# EAGLE design CBM Drive ID Switch Rev 1.1 (EAGLE 9.7.0)
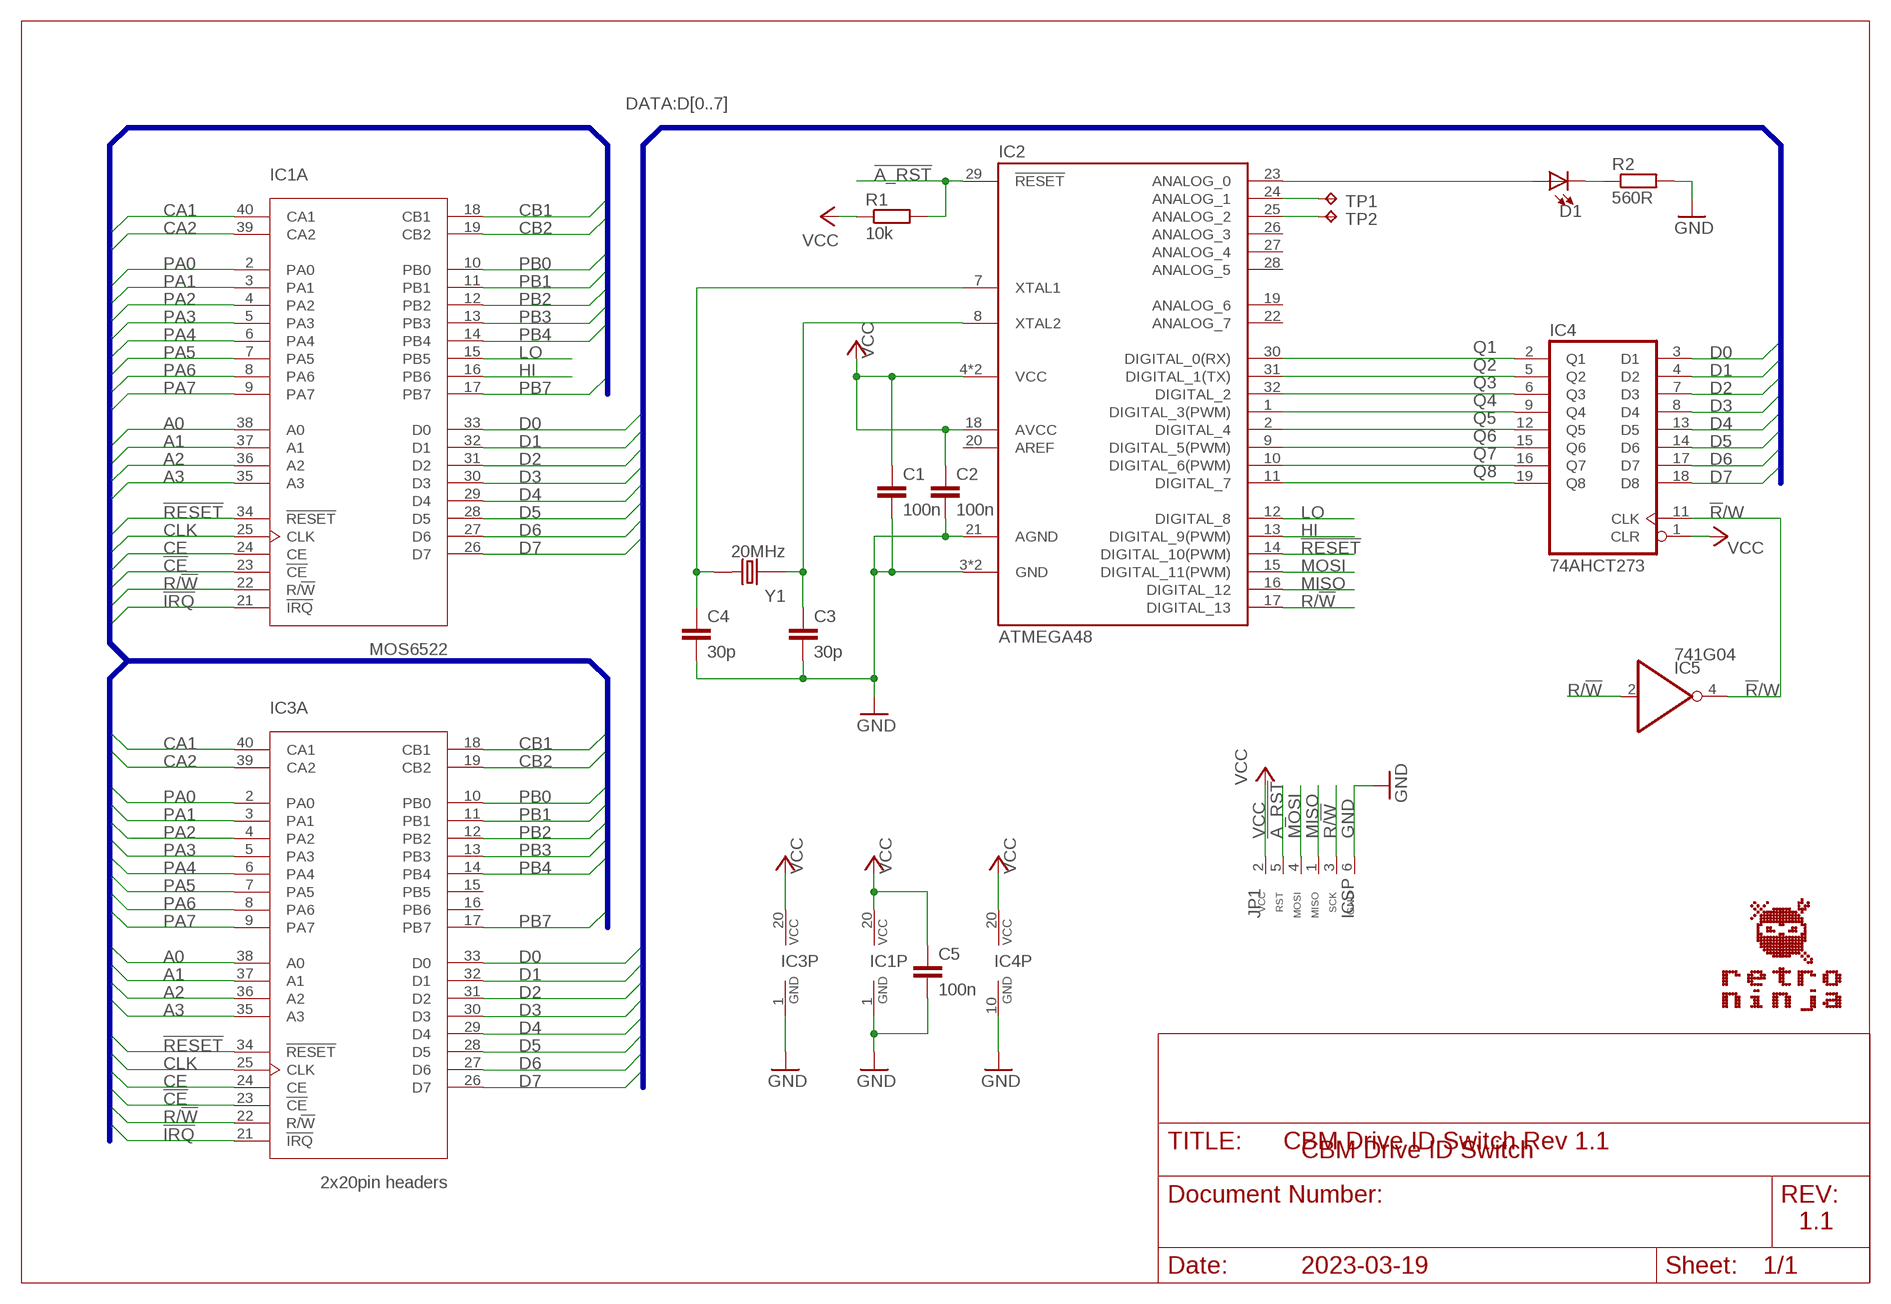
[diagram p0: schematic, sheet 1]

## Parts
C1  100n  C-EUC0805  [C0805]
C2  100n  C-EUC0805  [C0805]
C3  30p  C-EUC0805  [C0805]
C4  30p  C-EUC0805  [C0805]
C5  100n  C-EUC0805  [C0805]
D1  LED_0805  [LED0805]
IC1  MOS6522  MOS6522_HEADERS-F  [DIL40-6_HEADERS-F]
IC2  ATMEGA48  ARDUINO_168_328_TQFP  [TQFP-32]
IC3  2x20pin headers  MOS6522_ROUND_BOTTOMPINS  [DIL40-6_ROUND_BOTTOMPINS]
IC4  74AHCT273  74273N_NARROW  [SO20_NARROW]
IC5  741G04  741G04_SOT23  [SOT23-5]
JP1  ICSP  ICSP_CONNECTOR_6_ALT  [HEADER_2X3_ALT]
R1  10k  R-EU_R0805  [R0805]
R2  560R  R-EU_R0805  [R0805]
TP1  TPTP20SQ  [TP20SQ]
TP2  TPTP20SQ  [TP20SQ]
Y1  20MHz  CRYSTAL  [CRYSTAL_SMD-2_7X4X2.3]

## Nets
!A_RST: IC2.29(!RESET) JP1.5(RST) R1.2
!CE: IC1.23(A:!CE) IC3.23(A:!CE)
!IRQ: IC1.21(A:!IRQ) IC3.21(A:!IRQ)
!R!/W: IC4.11(CLK) IC5.4(O)
!RESET: IC1.34(A:!RESET) IC2.14(DIGITAL_10(PWM)) IC3.34(A:!RESET)
A0: IC1.38(A:A0) IC3.38(A:A0)
A1: IC1.37(A:A1) IC3.37(A:A1)
A2: IC1.36(A:A2) IC3.36(A:A2)
A3: IC1.35(A:A3) IC3.35(A:A3)
CA1: IC1.40(A:CA1) IC3.40(A:CA1)
CA2: IC1.39(A:CA2) IC3.39(A:CA2)
CB1: IC1.18(A:CB1) IC3.18(A:CB1)
CB2: IC1.19(A:CB2) IC3.19(A:CB2)
CE: IC1.24(A:CE) IC3.24(A:CE)
CLK: IC1.25(A:CLK) IC3.25(A:CLK)
D0: IC1.33(A:D0) IC3.33(A:D0) IC4.3(D1)
D1: IC1.32(A:D1) IC3.32(A:D1) IC4.4(D2)
D2: IC1.31(A:D2) IC3.31(A:D2) IC4.7(D3)
D3: IC1.30(A:D3) IC3.30(A:D3) IC4.8(D4)
D4: IC1.29(A:D4) IC3.29(A:D4) IC4.13(D5)
D5: IC1.28(A:D5) IC3.28(A:D5) IC4.14(D6)
D6: IC1.27(A:D6) IC3.27(A:D6) IC4.17(D7)
D7: IC1.26(A:D7) IC3.26(A:D7) IC4.18(D8)
GND: C1.2 C2.2 C3.2 C4.2 C5.2 IC1.1(P:GND) IC2.3(GND) IC2.5(GND) IC2.21(AGND) IC3.1(P:GND) IC4.10(GND) JP1.6(GND) R2.2
HI: IC1.16(A:PB6) IC2.13(DIGITAL_9(PWM))
LO: IC1.15(A:PB5) IC2.12(DIGITAL_8)
MISO: IC2.16(DIGITAL_12) JP1.1(MISO)
MOSI: IC2.15(DIGITAL_11(PWM)) JP1.4(MOSI)
N$1: IC2.24(ANALOG_1) TP1.TP
N$2: IC2.25(ANALOG_2) TP2.TP
N$16: C3.1 IC2.8(XTAL2) Y1.1
N$17: C4.1 IC2.7(XTAL1) Y1.2
N$25: D1.A IC2.23(ANALOG_0)
N$26: D1.C R2.1
PA0: IC1.2(A:PA0) IC3.2(A:PA0)
PA1: IC1.3(A:PA1) IC3.3(A:PA1)
PA2: IC1.4(A:PA2) IC3.4(A:PA2)
PA3: IC1.5(A:PA3) IC3.5(A:PA3)
PA4: IC1.6(A:PA4) IC3.6(A:PA4)
PA5: IC1.7(A:PA5) IC3.7(A:PA5)
PA6: IC1.8(A:PA6) IC3.8(A:PA6)
PA7: IC1.9(A:PA7) IC3.9(A:PA7)
PB0: IC1.10(A:PB0) IC3.10(A:PB0)
PB1: IC1.11(A:PB1) IC3.11(A:PB1)
PB2: IC1.12(A:PB2) IC3.12(A:PB2)
PB3: IC1.13(A:PB3) IC3.13(A:PB3)
PB4: IC1.14(A:PB4) IC3.14(A:PB4)
PB7: IC1.17(A:PB7) IC3.17(A:PB7)
Q1: IC2.30(DIGITAL_0(RX)) IC4.2(Q1)
Q2: IC2.31(DIGITAL_1(TX)) IC4.5(Q2)
Q3: IC2.32(DIGITAL_2) IC4.6(Q3)
Q4: IC2.1(DIGITAL_3(PWM)) IC4.9(Q4)
Q5: IC2.2(DIGITAL_4) IC4.12(Q5)
Q6: IC2.9(DIGITAL_5(PWM)) IC4.15(Q6)
Q7: IC2.10(DIGITAL_6(PWM)) IC4.16(Q7)
Q8: IC2.11(DIGITAL_7) IC4.19(Q8)
R/!W: IC1.22(A:R/!W) IC2.17(DIGITAL_13) IC3.22(A:R/!W) IC5.2(I) JP1.3(SCK)
VCC: C1.1 C2.1 C5.1 IC1.20(P:VCC) IC2.4(VCC) IC2.6(VCC) IC2.18(AVCC) IC3.20(P:VCC) IC4.1(CLR) IC4.20(VCC) JP1.2(VCC) R1.1
Unconnected: IC2.19(ANALOG_6) IC2.20(AREF) IC2.22(ANALOG_7) IC2.26(ANALOG_3) IC2.27(ANALOG_4) IC2.28(ANALOG_5) IC3.15(A:PB5) IC3.16(A:PB6)

## Buses
DATA:D[0..7]
A[0..3],CA[1..2],CB[1..2],CE,!CE,CLK,!IRQ,PA[0..7],PB[0..7],!RESET,R/!W

## Notes on the sheet
- CBM Drive ID Switch
- 1.1
- 2023-03-19

## Power pins joined to a net without a drawn wire
GND: IC5.3(GND)
VCC: IC5.5(VCC)

## Library data of the parts
C1-C5 = rcl:C-EU: CAPACITOR, European symbol; SPICEPREFIX: C
D1 = Per (Fusion 360):LED
IC1 IC3 = Per (Fusion 360):MOS6522
IC2 = Per (Fusion 360):ARDUINO_168_328
IC4 = Per (Fusion 360):74*273
IC5 = Per (Fusion 360):74*1G04
JP1 = Per (Fusion 360):ICSP_CONNECTOR: PIN HEADER
R1 R2 = rcl:R-EU_: RESISTOR, European symbol; SPICEPREFIX: R
TP1 TP2 = testpad:TP: Test pad
Y1 = Per (Fusion 360):CRYSTAL

## Board
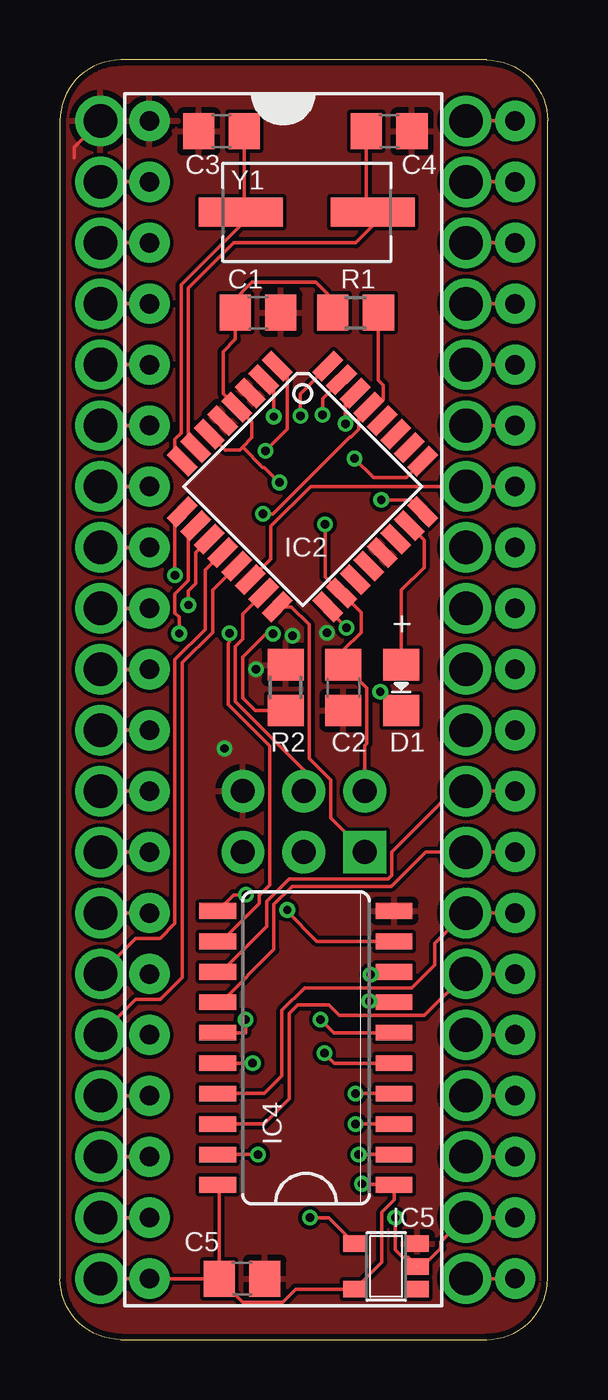
[diagram p1: board, top side]
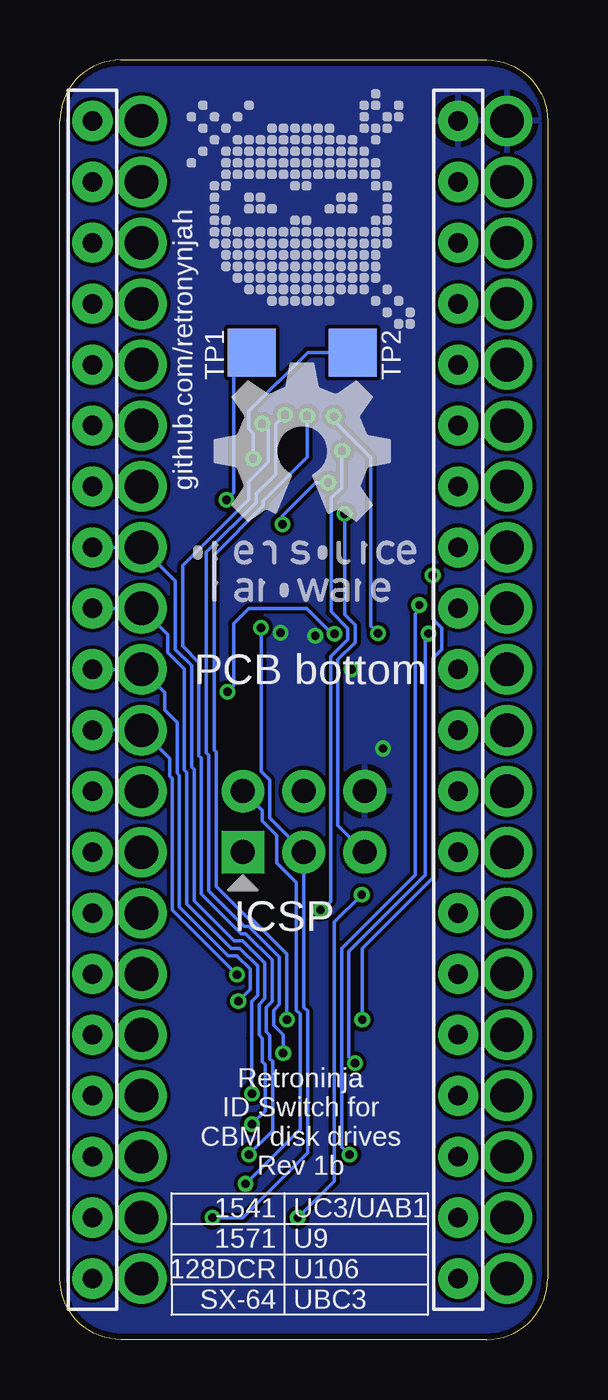
[diagram p2: board, bottom side, seen from below]

Size 20.32 x 53.34 mm. Coordinates in mm from the lower left corner, seen from the top.
Outline: 2.54,0 17.78,0 arc90 20.32,2.54 20.32,50.8 arc90 17.78,53.34 2.54,53.34 arc90 0,50.8 0,2.54 arc90 2.54,0
Copper layers (1*16): Top 0.035mm / dielectric 1.5mm / Bottom 0.035mm
Design rules "SeeedStudio_2layer_DRU_no_angle_20140221": minimum track width 6mil, minimum drill 12mil, track to track 6mil, track to pad 6mil, pad to pad 6mil, via to via 6mil, smd to smd 0mil, copper to edge 10mil, drill to drill 10mil, minimum pad ring 10mil, minimum via ring 6mil, stop-mask expansion 2mil, vias tented up to drill 100mil, thermal gap 10mil

### Footprints (pad centres in the part's own frame; a part is rotated, then mirrored left to right if it is on the bottom)
C0805 = smd 1.3 x 1.5: 1 -0.95,0; 2 0.95,0
LED0805 = smd 1.3 x 1.5: A -0.95,0; C 0.95,0
DIL40-6_HEADERS-F = drill 1.4: 1 -24.13,-7.62; 2 -21.59,-7.62; 3 -19.05,-7.62; 4 -16.51,-7.62; 5 -13.97,-7.62; 6 -11.43,-7.62; 7 -8.89,-7.62; 8 -6.35,-7.62; 9 -3.81,-7.62; 10 -1.27,-7.62; 11 1.27,-7.62; 12 3.81,-7.62; 13 6.35,-7.62; 14 8.89,-7.62; 15 11.43,-7.62; 16 13.97,-7.62; 17 16.51,-7.62; 18 19.05,-7.62; 19 21.59,-7.62; 20 24.13,-7.62; 21 24.13,7.62; 22 21.59,7.62; 23 19.05,7.62; 24 16.51,7.62; 25 13.97,7.62; 26 11.43,7.62; 27 8.89,7.62; 28 6.35,7.62; 29 3.81,7.62; 30 1.27,7.62; 31 -1.27,7.62; 32 -3.81,7.62; 33 -6.35,7.62; 34 -8.89,7.62; 35 -11.43,7.62; 36 -13.97,7.62; 37 -16.51,7.62; 38 -19.05,7.62; 39 -21.59,7.62; 40 -24.13,7.62
TQFP-32 = smd 1.27 x 0.559: 1 -4.293,2.8; 2 -4.293,2; 3 -4.293,1.2; 4 -4.293,0.4; 5 -4.293,-0.4; 6 -4.293,-1.2; 7 -4.293,-2; 8 -4.293,-2.8; 17 4.293,-2.8; 18 4.293,-2; 19 4.293,-1.2; 20 4.293,-0.4; 21 4.293,0.4; 22 4.293,1.2; 23 4.293,2; 24 4.293,2.8 | smd 0.559 x 1.27: 9 -2.8,-4.293; 10 -2,-4.293; 11 -1.2,-4.293; 12 -0.4,-4.293; 13 0.4,-4.293; 14 1.2,-4.293; 15 2,-4.293; 16 2.8,-4.293; 25 2.8,4.293; 26 2,4.293; 27 1.2,4.293; 28 0.4,4.293; 29 -0.4,4.293; 30 -1.2,4.293; 31 -2,4.293; 32 -2.8,4.293
DIL40-6_ROUND_BOTTOMPINS = drill 0.813 pad 1.676: 1 -24.13,-7.62; 2 -21.59,-7.62; 3 -19.05,-7.62; 4 -16.51,-7.62; 5 -13.97,-7.62; 6 -11.43,-7.62; 7 -8.89,-7.62; 8 -6.35,-7.62; 9 -3.81,-7.62; 10 -1.27,-7.62; 11 1.27,-7.62; 12 3.81,-7.62; 13 6.35,-7.62; 14 8.89,-7.62; 15 11.43,-7.62; 16 13.97,-7.62; 17 16.51,-7.62; 18 19.05,-7.62; 19 21.59,-7.62; 20 24.13,-7.62; 21 24.13,7.62; 22 21.59,7.62; 23 19.05,7.62; 24 16.51,7.62; 25 13.97,7.62; 26 11.43,7.62; 27 8.89,7.62; 28 6.35,7.62; 29 3.81,7.62; 30 1.27,7.62; 31 -1.27,7.62; 32 -3.81,7.62; 33 -6.35,7.62; 34 -8.89,7.62; 35 -11.43,7.62; 36 -13.97,7.62; 37 -16.51,7.62; 38 -19.05,7.62; 39 -21.59,7.62; 40 -24.13,7.62
SO20_NARROW = smd 0.66 x 1.524: 1 -5.369,-3.765; 2 -4.099,-3.765; 3 -2.829,-3.765; 4 -1.559,-3.765; 5 -0.289,-3.765; 6 0.981,-3.765; 7 2.251,-3.765; 8 3.521,-3.765; 9 4.791,-3.765; 10 6.061,-3.765; 11 6.061,3.585; 12 4.791,3.585; 13 3.521,3.585; 14 2.251,3.585; 15 0.981,3.585; 16 -0.289,3.585; 17 -1.559,3.585; 18 -2.829,3.585; 19 -4.099,3.585; 20 -5.369,3.585
SOT23-5 = smd 0.69 x 0.99: 1 -0.95,-1.29; 2 0,-1.29; 3 0.95,-1.29; 4 0.95,1.3; 5 -0.95,1.3
HEADER_2X3_ALT = drill 1 pad 1.778 square: 1 -2.54,-1.27 | drill 1 pad 1.778: 2 -2.54,1.27; 3 0,-1.27; 4 0,1.27; 5 2.54,-1.27; 6 2.54,1.27
R0805 = smd 1.3 x 1.5: 1 -0.95,0; 2 0.95,0
TP20SQ = smd 2 x 2: TP 0,0
CRYSTAL_SMD-2_7X4X2.3 = smd 3.5 x 1.2: 1 -2.75,0; 2 2.75,0

### Placement (x,y rotation side)
C1  8.26,42.8 0 top
C2  11.81,27.18 270 top
C3  6.73,50.37 180 top
C4  13.72,50.37 0 top
C5  7.59,2.54 0 top
D1  14.22,27.18 270 top
IC1  9.3,26.67 270 top
IC2  10.11,35.56 315 top
IC3  11.35,26.67 270 top
IC4  10.16,11.81 90 top
IC5  13.59,3.05 90 top
JP1  10.16,21.59 0 bottom
R1  12.32,42.8 0 top
R2  9.4,27.18 90 top
TP1  12.32,41.15 0 bottom
TP2  8.13,41.15 0 bottom
U$1  [RETRONINJA_NOTEXT_10MM]  10.29,47.37 0 bottom
U$2  [OSHW_10MM]  14.99,30.73 0 bottom
Y1  10.29,46.99 0 top

### Tracks (layer width: path | path; a pad name or v marks a point on that pad's centre or on a via)
!A_RST  (via drill 0.35)
  Top 0.152: R1.2 13.27,40 13.48,39.79 13.48,39.19 IC2.29 12.45,38.47 12.45,37.95 12.12,37.62 12.08,37.62 8.88,34.42 v8.46,34.42
  Bottom 0.152: JP1.5 8.74,21.44 8.74,28.34 8.02,29.06 8.02,29.77 8.46,30.22 v8.46,34.42
!CE
  Top 0.152: IC1.23 IC3.23
!IRQ
  Top 0.152: IC1.21 IC3.21
!R!/W  (via drill 0.35)
  Top 0.152: IC5.4 11.21,5.08 v10.41,5.08 | v7.75,18.54 7.24,18.54 IC4.11
  Bottom 0.152: v10.41,5.08 8.89,6.6 8.89,17.4 v7.75,18.54
!RESET
  Top 0.152: IC3.34 IC1.34 10.45,35.56 8.79,33.9 8.79,32.54 IC2.14
A0
  Top 0.152: IC1.38 IC3.38
A1
  Top 0.152: IC1.37 IC3.37
A2
  Top 0.152: IC1.36 IC3.36
A3
  Top 0.152: IC1.35 IC3.35
CA1
  Top 0.152: IC1.40 IC3.40
CA2
  Top 0.152: IC3.39 IC1.39
CB1
  Top 0.152: IC1.18 IC3.18
CB2
  Top 0.152: IC1.19 IC3.19
CE
  Top 0.152: IC1.24 IC3.24
CLK
  Top 0.152: IC3.25 IC1.25
D0  (via drill 0.35)
  Top 0.152: IC4.3 v12.32,8.98
  Bottom 0.152: IC3.33 IC1.33 15.52,31.61 15.52,28.77 14.83,28.09 14.83,23.87 14.73,23.77 14.73,18.29 13.06,16.61 12.7,16.61 11.78,15.7 11.78,14.22 12.03,13.98 12.03,12.69 11.88,12.55 11.88,11.58 11.76,11.46 11.76,9.54 v12.32,8.98
D1  (via drill 0.35)
  Top 0.152: IC4.4 v12.32,10.25
  Bottom 0.152: IC3.32 IC1.32 15.82,29.38 15.82,28.65 15.14,27.96 15.14,23.74 15.04,23.64 15.04,18.16 13.18,16.31 12.82,16.31 12.09,15.57 12.09,14.35 12.33,14.1 12.33,12.57 12.32,12.55 v12.32,10.25
D2  (via drill 0.35)
  Top 0.152: IC4.7 12.93,14.06 v12.89,14.1
  Bottom 0.152: IC3.31 IC1.31 15.95,26.97 15.95,26.23 15.44,25.73 15.44,23.62 15.34,23.52 15.34,18.04 13.31,16 12.95,16 12.39,15.45 12.39,14.6 v12.89,14.1
D3  (via drill 0.35)
  Top 0.152: IC4.8 13.07,15.33 v12.95,15.21
  Bottom 0.152: IC3.30 IC1.30 15.75,24.22 15.75,23.49 15.65,23.39 15.65,17.91 13.43,15.7 v12.95,15.21
D4
  Top 0.152: IC3.29 IC1.29 16.36,22.86 13.82,20.32 13.82,19.34 13.68,19.2 9.55,19.2 8.61,18.26 8.61,17.22 6.72,15.33 IC4.13
D5
  Top 0.152: IC3.28 IC1.28 15.23,20.32 13.81,18.9 9.67,18.9 8.91,18.14 8.91,16.25 6.72,14.06 IC4.14
D6
  Top 0.152: IC4.17 8.51,10.25 9.25,10.99 9.25,13.71 10.2,14.66 14.67,14.66 15.62,15.61 15.62,16.51 16.89,17.78 IC1.27 IC3.27
D7
  Top 0.152: IC4.18 8.51,8.98 9.55,10.03 9.55,13.59 9.91,13.94 11.2,13.94 11.64,13.5 15.19,13.5 IC1.26 IC3.26
GND  (via drill 0.35)
  Top 0.152: IC1.1 0.58,49.7 0.58,49.28
  other vias: 9.68,29.34 6.86,24.64 8.17,27.94 11.13,29.46
  pour Bottom: 0.08,0.08 20.24,0.08 20.24,53.26 0.08,53.26
  pour Top: 0.08,0.08 20.24,0.08 20.24,53.26 0.08,53.26
HI
  Top 0.152: IC1.16 3.16,14.17 4.17,14.17 5.1,15.1 5.1,28.22 6.36,29.48 6.36,31.25 IC2.13
LO
  Top 0.152: IC1.15 3.16,16.71 4.17,16.71 4.79,17.34 4.79,28.34 6.06,29.61 6.06,32.07 IC2.12
MISO
  Top 0.152: JP1.1 11.28,21.74 11.28,23.32 10.38,24.22 10.38,29.81 9.64,30.55 IC2.16
MOSI
  Top 0.152: JP1.4 10.16,23.74 7.31,26.59 7.31,28.9 7.62,29.21 7.62,30.24 IC2.15
N$1  (via drill 0.35)
  Top 0.152: IC2.24 14.63,35 v13.39,35
  Bottom 0.152: v13.39,35 13.08,35.31 13.08,40.39 TP1.TP
N$2  (via drill 0.35)
  Top 0.152: v12.27,36.73 13.07,35.92 14.43,35.92 IC2.25
  Bottom 0.152: TP2.TP 10,41.15 11.22,39.92 11.24,39.92 12.45,38.71 12.45,37.95 12.27,37.77 v12.27,36.73
N$16
  Top 0.152: C3.1 7.68,47.39 Y1.1 7.54,46.45 5.05,43.97 5.04,43.96 5.04,37.79 4.78,37.53 4.78,36.92 IC2.8
N$17
  Top 0.152: C4.1 12.77,47.26 Y1.2 13.04,46.44 12.32,45.72 7.24,45.72 5.35,43.83 5.35,37.49 IC2.7
N$25
  Top 0.152: D1.A 14.22,31.24 15.17,32.19 15.17,33.33 IC2.23
N$26  (via drill 0.35)
  Top 0.152: R2.1 8.13,26.23 7.61,26.74 7.61,28.45 8.58,29.42 v8.88,29.42 | v13.35,27 14.12,26.23 D1.C
  Bottom 0.152: v13.35,27 13.08,27.26 13.08,29.84 12.45,30.48 10.04,30.48 8.98,29.42 v8.88,29.42
PA0
  Top 0.152: IC3.2 IC1.2
PA1
  Top 0.152: IC1.3 IC3.3
PA2
  Top 0.152: IC3.4 IC1.4
PA3
  Top 0.152: IC1.5 IC3.5
PA4
  Top 0.152: IC1.6 IC3.6
PA5
  Top 0.152: IC1.7 IC3.7
PA6
  Top 0.152: IC1.8 IC3.8
PA7
  Top 0.152: IC1.9 IC3.9
PB0
  Top 0.152: IC1.10 IC3.10
PB1
  Top 0.152: IC1.11 IC3.11
PB2
  Top 0.152: IC1.12 IC3.12
PB3
  Top 0.152: IC1.13 IC3.13
PB4
  Top 0.152: IC1.14 IC3.14
PB7
  Top 0.152: IC1.17 IC3.17
Q1  (via drill 0.35)
  Top 0.152: IC4.2 v12.45,7.71 | v11.89,38.18 11.89,39.04 IC2.30
  Bottom 0.152: v11.89,38.18 11.64,37.93 11.64,36.57 12.45,35.76 12.45,35.02 15.21,32.26 15.21,28.9 14.53,28.21 14.53,24.34 14.43,24.23 14.43,18.57 12.78,16.92 12.57,16.92 11.48,15.82 11.48,14.09 11.72,13.85 11.72,12.82 11.58,12.67 11.58,11.71 11.46,11.59 11.46,8.7 v12.45,7.71
Q2  (via drill 0.35)
  Top 0.152: v10.94,38.55 10.94,39.22 IC2.31 | IC4.5 11.44,11.52 v11.02,11.94
  Bottom 0.152: v10.94,38.55 11.34,38.15 11.34,36.06 12.14,35.26 12.14,34.9 14.22,32.82 14.22,24.46 14.12,24.36 14.12,18.69 12.65,17.22 12.45,17.22 11.17,15.95 11.17,13.97 11.42,13.72 11.42,13.11 11.02,12.71 v11.02,11.94
Q3  (via drill 0.35)
  Top 0.152: v10.02,38.51 10.01,38.52 10.01,39.42 IC2.32 | IC4.6 11.4,12.79 v10.86,13.34
  Bottom 0.152: v10.02,38.51 10.01,38.49 10.01,36.79 11.84,34.96 11.84,34.77 13.9,32.71 13.9,24.57 13.82,24.49 13.82,18.9 12.45,17.53 12.32,17.53 10.86,16.07 v10.86,13.34
Q4  (via drill 0.35)
  Top 0.152: IC4.9 10.7,16.6 9.47,17.84 v9.47,17.91 | IC2.1 9.46,40.16 9.46,37.94 v8.56,37.04
  Bottom 0.152: v8.56,37.04 8.59,37.02 8.59,35.5 9.02,35.07 9.02,30.35 8.32,29.65 8.32,29.19 9.04,28.46 9.04,18.26 9.4,17.91 v9.47,17.91
Q5  (via drill 0.35)
  Top 0.152: v7.06,29.44 7.06,29.08 7,29.02 7,26.47 8.74,24.73 8.74,18.94 8.3,18.51 8.3,18.18 6.72,16.6 IC4.12 | IC2.2 8.91,39.59 v8.91,38.47
  Bottom 0.152: v7.06,29.44 7.37,29.74 7.37,36.76 8.91,38.3 v8.91,38.47
Q6  (via drill 0.35)
  Top 0.152: IC4.15 7.75,12.79 7.75,13.31 v7.72,13.34 | v4.79,31.86 4.79,32.52 4.79,33.59 4.78,33.59 4.78,34.2 IC2.9
  Bottom 0.152: v4.79,31.86 4.79,31.83 4.79,30.04 4.41,29.66 4.41,28.76 4.79,28.38 4.79,19.24 7.72,16.3 v7.72,13.34
Q7  (via drill 0.35)
  Top 0.152: v4.97,29.43 4.97,30.11 4.79,30.29 4.79,31.08 5.35,31.63 5.35,33.62 IC2.10 | v8.03,11.52 IC4.16
  Bottom 0.152: v4.97,29.43 5.1,29.3 5.1,19.36 8.28,16.18 8.28,11.77 v8.03,11.52
Q8  (via drill 0.35)
  Top 0.152: IC4.19 v8.26,7.71 | v5.35,30.62 5.35,31.2 5.65,31.51 5.65,32.8 IC2.11
  Bottom 0.152: v5.35,30.62 5.35,30.42 5.53,30.24 5.53,19.37 8.59,16.31 8.59,8.04 v8.26,7.71
R/!W  (via drill 0.35)
  Top 0.152: IC3.22 IC1.22 16.89,5.08 15.88,4.06 15.88,3.81 15.11,3.05 IC5.2 14.5,3.42 14.29,3.42 13.97,3.74 v13.97,5.08 | v11.94,29.67 11.16,30.45 IC2.17
  Bottom 0.152: v11.94,29.67 11.94,23.68 11.58,23.32 11.58,21.74 JP1.3 10.16,13.85 10,13.69 10,7.78 12.7,5.08 v13.97,5.08
VCC  (via drill 0.35)
  Top 0.152: R1.1 11.37,43.37 10.67,44.07 8,44.07 7.24,43.31 7.24,42.87 C1.1 7.3,41.7 6.79,41.19 6.79,39.44 IC2.4 8,38.23 8,37.59 7.61,37.2 | IC1.20 IC3.20 C5.1 | C5.1 6.64,6.38 IC4.20 | C5.1 7.62,1.56 9.28,1.56 9.82,2.1 IC5.5 13.41,3.22 13.41,5.31 13.93,5.82 IC4.1 13.89,6.48 12.6,6.48 v12.59,6.49 | JP1.2 12.7,24.77 12.79,24.86 12.79,27.15 C2.1 11.81,28.73 12.54,29.47 12.54,30.3 IC2.18 11.05,31.79 v11.05,33.99 | IC2.6 6.89,37.08 7.49,37.08 7.61,37.2 | v9.14,35.73 8.51,36.36 8.46,36.36 7.61,37.2
  Bottom 0.152: JP1.2 11.89,22.05 11.89,21.62 11.28,21.01 11.28,19.86 10.46,19.04 10.46,13.72 10.3,13.56 10.3,8.77 v12.59,6.49 | v11.05,33.99 11.05,34.33 9.65,35.73 v9.14,35.73

### Text on the board
tPlace: +
bPlace: github.com/retronynjah | PCB bottom | Retroninja / ID Switch for / CBM disk drives / Rev 1b | UC3/UAB1 / U9 / U106 / UBC3 | 1541 / 1571 / 128DCR / SX-64